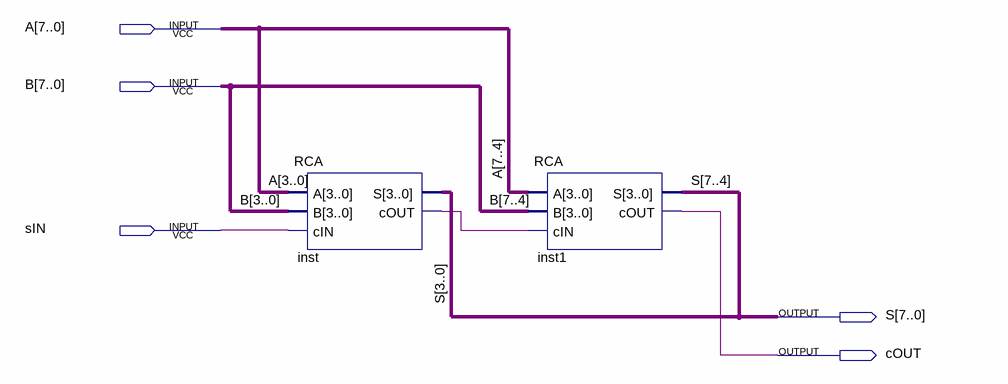
[diagram p0: schematic sheet]
// Quartus schematic RCA8.bdf as structural Verilog: 2 symbols, 5 pins
module RCA8 (
  input  [7:0] A,
  input  [7:0] B,
  input  sIN,
  output [7:0] S,
  output cOUT
);

  wire inst_cout;

  RCA inst (.A(A[3:0]), .B(B[3:0]), .cIN(sIN), .S(S[3:0]), .cOUT(inst_cout));
  RCA inst1 (.A(A[7:4]), .B(B[7:4]), .cIN(inst_cout), .S(S[7:4]), .cOUT(cOUT));
endmodule
